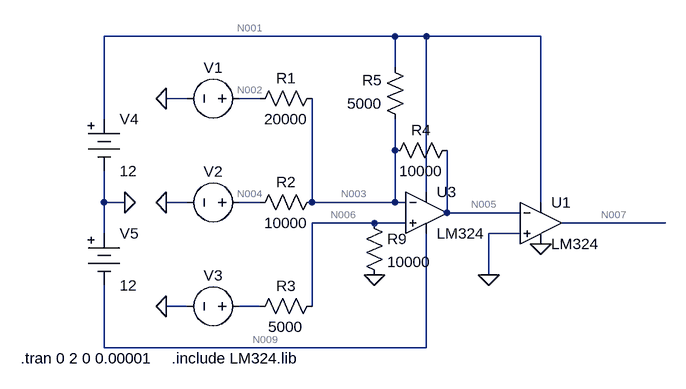
[diagram p0: schematic single neuron.asc]
single neuron.asc, the LTspice schematic file:
Version 4.1
SHEET 1 880 680
WIRE 96 -96 -352 -96
WIRE 144 -96 96 -96
WIRE 320 -96 144 -96
WIRE 96 -48 96 -96
WIRE -224 0 -256 0
WIRE -112 0 -144 0
WIRE -352 32 -352 -96
WIRE 96 80 96 32
WIRE 144 144 144 -96
WIRE -352 160 -352 112
WIRE -320 160 -352 160
WIRE -224 160 -256 160
WIRE -112 160 -144 160
WIRE -32 160 -32 0
WIRE 96 160 96 80
WIRE 96 160 -32 160
WIRE 112 160 96 160
WIRE 320 160 320 -96
WIRE 176 176 176 80
WIRE 288 176 176 176
WIRE 64 192 -32 192
WIRE 112 192 64 192
WIRE 512 192 352 192
WIRE -352 208 -352 160
WIRE 288 208 240 208
WIRE 240 272 240 208
WIRE -224 320 -256 320
WIRE -112 320 -144 320
WIRE -32 320 -32 192
WIRE -352 384 -352 288
WIRE 144 384 144 208
WIRE 144 384 -352 384
FLAG -320 160 0
FLAG 64 272 0
FLAG -256 320 0
FLAG -256 160 0
FLAG -256 0 0
FLAG 320 224 0
FLAG 240 272 0
SYMBOL res -16 -16 R90
WINDOW 0 0 56 VBottom 2
WINDOW 3 32 56 VTop 2
SYMATTR InstName R1
SYMATTR Value 20000
SYMBOL res -16 144 R90
WINDOW 0 0 56 VBottom 2
WINDOW 3 32 56 VTop 2
SYMATTR InstName R2
SYMATTR Value 10000
SYMBOL res -16 304 R90
WINDOW 0 0 56 VBottom 2
WINDOW 3 32 56 VTop 2
SYMATTR InstName R3
SYMATTR Value 5000
SYMBOL res 192 64 R90
WINDOW 0 0 56 VBottom 2
WINDOW 3 32 56 VTop 2
SYMATTR InstName R4
SYMATTR Value 10000
SYMBOL voltage -128 0 R90
WINDOW 0 -32 56 VBottom 2
WINDOW 3 32 56 Invisible 2
WINDOW 123 0 0 Left 0
WINDOW 39 0 0 Left 0
SYMATTR InstName V1
SYMATTR Value PULSE(0 12 0 1u 1u 0.75 1)
SYMBOL voltage -128 160 R90
WINDOW 0 -32 56 VBottom 2
WINDOW 3 32 56 Invisible 2
WINDOW 123 0 0 Left 0
WINDOW 39 0 0 Left 0
SYMATTR InstName V2
SYMATTR Value PULSE(0 -12 0 1u 1u 0.5 1)
SYMBOL voltage -128 320 R90
WINDOW 0 -32 56 VBottom 2
WINDOW 3 32 56 Invisible 2
WINDOW 123 0 0 Left 0
WINDOW 39 0 0 Left 0
SYMATTR InstName V3
SYMATTR Value PULSE(0 12 0 1u 1u 0.25 1)
SYMBOL Misc\\battery -352 16 R0
WINDOW 123 0 0 Left 0
WINDOW 39 0 0 Left 0
SYMATTR InstName V4
SYMATTR Value 12
SYMBOL Misc\\battery -352 192 R0
WINDOW 123 0 0 Left 0
WINDOW 39 0 0 Left 0
SYMATTR InstName V5
SYMATTR Value 12
SYMBOL OpAmps\\opamp2 144 112 R0
SYMATTR InstName U3
SYMATTR Value LM324
SYMBOL OpAmps\\opamp2 320 128 R0
SYMATTR InstName U1
SYMATTR Value LM324
SYMBOL res 48 176 R0
SYMATTR InstName R9
SYMATTR Value 10000
SYMBOL res 112 48 R180
WINDOW 0 36 76 Left 2
WINDOW 3 36 40 Left 2
SYMATTR InstName R5
SYMATTR Value 5000
TEXT -480 400 Left 2 !.tran 0 2 0 0.00001
TEXT -248 400 Left 2 !.include LM324.lib

The netlist it stands for:
* single neuron.asc
R1 N003 N002 20000
R2 N003 N004 10000
R3 N006 N008 5000
R4 N005 N003 10000
V1 N002 0 PULSE(0 12 0 1u 1u 0.75 1)
V2 N004 0 PULSE(0 -12 0 1u 1u 0.5 1)
V3 N008 0 PULSE(0 12 0 1u 1u 0.25 1)
V4 N001 0 12
V5 0 N009 12
X§U3 N006 N003 N001 N009 N005 LM324  ; pins In+ In- V+ V- OUT
X§U1 0 N005 N001 0 N007 LM324  ; pins In+ In- V+ V- OUT
R9 N006 0 10000
R5 N003 N001 5000
.tran 0 2 0 0.00001
.include LM324.lib
.backanno
.end

* Results of the author's LTspice run, read from the files saved beside the schematic
* Operating Point, zero values left out:
*   V(n006) = 132.9 µV
*   V(n001) = 12 V
*   V(n003) = 2.668 V
*   V(n005) = -12 V
*   V(n009) = -12 V
*   V(n007) = -123.5 mV
*   I(R3) = 26.58 nA
*   I(V1) = 133.4 µA
*   I(R5) = -1.866 mA
*   I(R1) = 133.4 µA
*   I(V2) = 266.8 µA
*   I(V4) = -3.074 mA
*   I(R2) = 266.8 µA
*   I(R4) = -1.466 mA
*   I(V5) = -793.9 µA
*   I(R9) = 13.29 nA
*   I(V3) = 26.58 nA
*   Ix(u1:1) = 11.24 pA
*   Ix(u1:2) = -1.427 mA
*   Ix(u1:3) = 405.9 µA
*   Ix(u1:4) = 2.146 mA
*   Ix(u3:1) = -39.86 nA
*   Ix(u3:2) = 16.71 pA
*   Ix(u3:3) = 801.9 µA
*   Ix(u3:4) = -793.9 µA
*   Ix(u3:5) = 2.893 mA
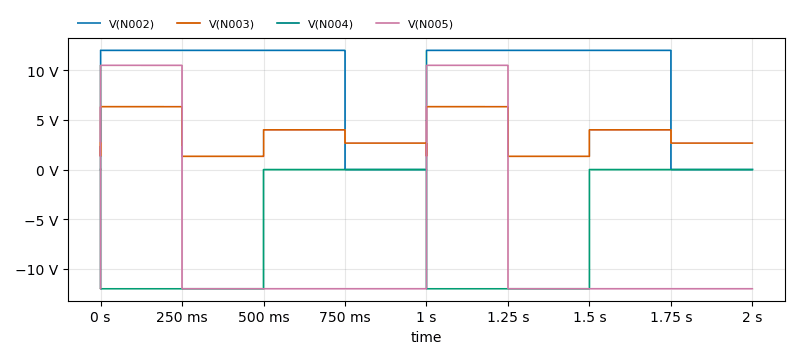
[diagram p1: Transient Analysis of single neuron.asc, plotted from the saved traces]
* Transient Analysis, 1 run:
*   V(N002): min 0 V, max 12 V, average 9 V, rms 10.39 V, last 0 V
*   V(N003): min 1.334 V, max 6.333 V, average 3.584 V, rms 4.031 V, last 2.668 V
*   V(N004): min -12 V, max 0 V, average -6 V, rms 8.485 V, last 0 V
*   V(N005): min -12 V, max 10.5 V, average -6.373 V, rms 11.64 V, last -12 V